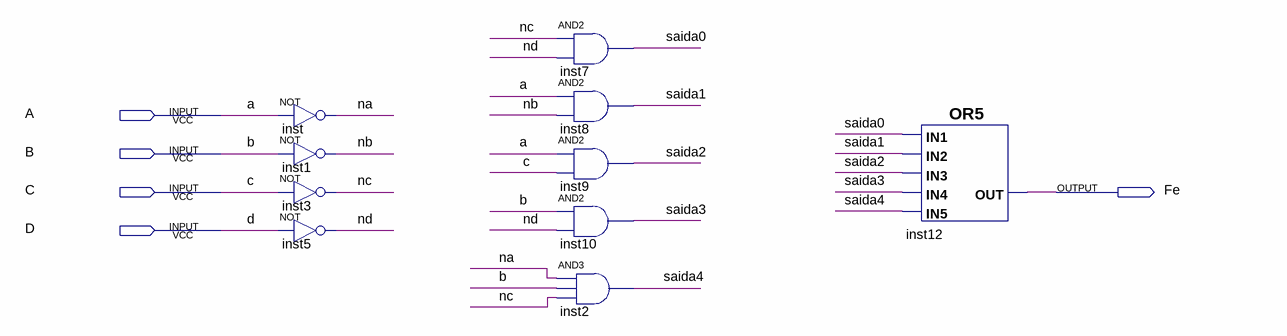
[diagram p0: schematic sheet]
// Quartus schematic FuncaoF.bdf as structural Verilog: 10 symbols, 5 pins
module FuncaoF (
  input  A,
  input  B,
  input  C,
  input  D,
  output Fe
);

  wire na, nb, nc, nd, saida0, saida1, saida2, saida3, saida4;

  not inst (na, A);
  not inst1 (nb, B);
  not inst3 (nc, C);
  not inst5 (nd, D);
  and inst7 (saida0, nc, nd);
  and inst8 (saida1, A, nb);
  and inst9 (saida2, A, C);
  and inst10 (saida3, B, nd);
  and inst2 (saida4, na, B, nc);
  or inst12 (Fe, saida0, saida1, saida2, saida3, saida4);
endmodule
